# EasyEDA schematic SCH_Boom-Crane-Controller_2025-03-01.json
TITLE: Sheet_1; REV: 1.0; Date: 2024-06-13; Sheet: 1/1; Drawn By: aarin.khadpe; Company: Your Company
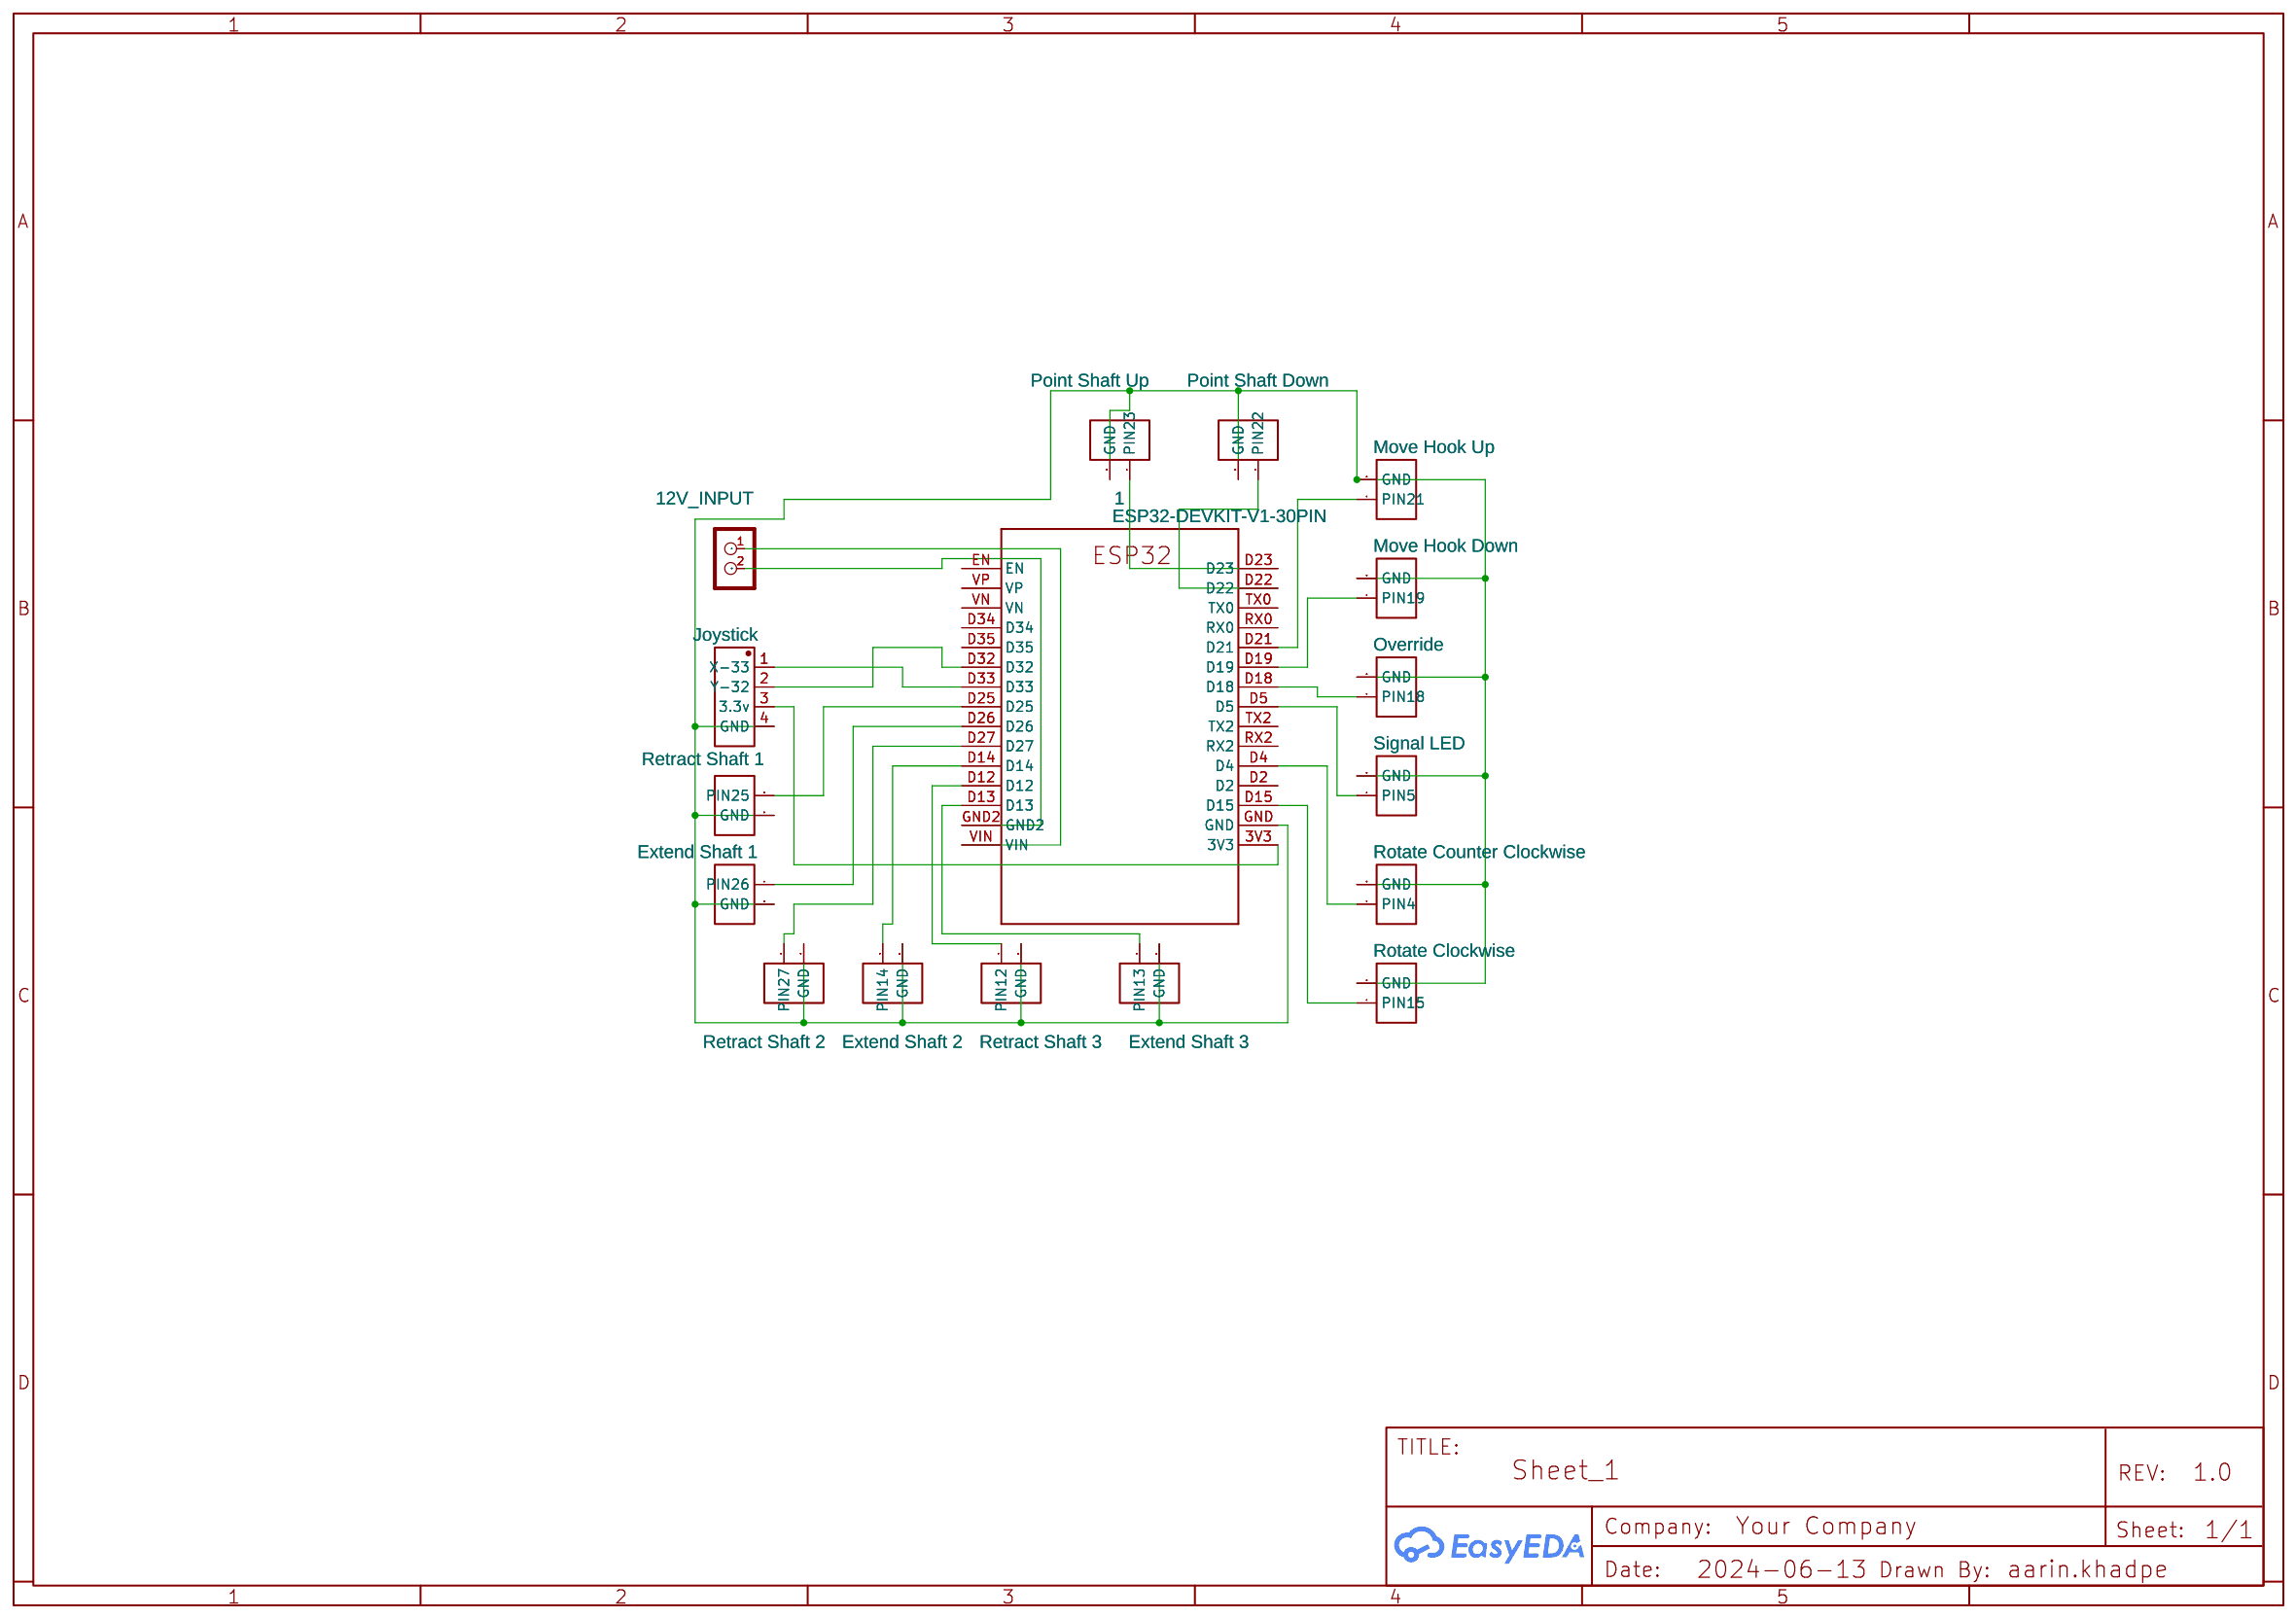
[diagram p0: schematic sheet]

## Parts
1  ESP32-DEVKIT-V1-30PIN  [ESP32-DEVKITV1_ESP32-DEVKITV1-30PINS]
12V_INPUT  CON_TERMINAL_BLOCK_02-5MM  [TERMINAL_BLOCK_2P_5]
H1  Joystick  [HDR-TH_4P-P2.54-V-M]
P1  Extend Shaft 1  [HDR-TH_2P-P2.54-V-F]
P2  Retract Shaft 1  [HDR-TH_2P-P2.54-V-F]
P3  Extend Shaft 2  [HDR-TH_2P-P2.54-V-F]
P4  Retract Shaft 2  [HDR-TH_2P-P2.54-V-F]
P5  Retract Shaft 3  [HDR-TH_2P-P2.54-V-F]
P6  Extend Shaft 3  [HDR-TH_2P-P2.54-V-F]
P7  Point Shaft Up  [HDR-TH_2P-P2.54-V-F]
P8  Point Shaft Down  [HDR-TH_2P-P2.54-V-F]
P9  Move Hook Down  [HDR-TH_2P-P2.54-V-F]
P10  Move Hook Up  [HDR-TH_2P-P2.54-V-F]
P11  Rotate Clockwise  [HDR-TH_2P-P2.54-V-F]
P12  Rotate Counter Clockwise  [HDR-TH_2P-P2.54-V-F]
P13  Override  [HDR-TH_2P-P2.54-V-F]
P14  Signal LED  [HDR-TH_2P-P2.54-V-F]

## Library data of the parts
1 = ESP32-DEVKIT-V1-30PIN: Contributor: petrawilliamleka
12V_INPUT = CON_TERMINAL_BLOCK_02-5MM: 2 poles wire to board terminal block; Contributor: DangerousPrototype
H1 = Header-Male-2.54_1x4_C59481: Supplier: LCSC; Manufacturer: null; Manufacturer Part: 排针 1*4P; Supplier Part: C59481; JLCPCB Part Class: Extended Part
P1-P14 = Header-Female-2.54_1x2: Supplier: LCSC; Manufacturer: BOOMELE(博穆精密); Manufacturer Part: 2.54-1*2P母; Supplier Part: C49661; JLCPCB Part Class: Extended Part

## Nets
Net-(1-3V3): 1.3V3 H1.3(3.3v)
Net-(1-D4): 1.D4 P12.1(PIN4)
Net-(1-D5): 1.D5 P14.1(PIN5)
Net-(1-D12): 1.D12 P5.1(PIN12)
Net-(1-D13): 1.D13 P6.1(PIN13)
Net-(1-D14): 1.D14 P3.1(PIN14)
Net-(1-D15): 1.D15 P11.1(PIN15)
Net-(1-D18): 1.D18 P13.1(PIN18)
Net-(1-D19): 1.D19 P9.1(PIN19)
Net-(1-D21): 1.D21 P10.1(PIN21)
Net-(1-D22): 1.D22 P8.1(PIN22)
Net-(1-D23): 1.D23 P7.1(PIN23)
Net-(1-D25): 1.D25 P2.1(PIN25)
Net-(1-D26): 1.D26 P1.1(PIN26)
Net-(1-D27): 1.D27 P4.1(PIN27)
Net-(1-D32): 1.D32 H1.2(Y-32)
Net-(1-D33): 1.D33 H1.1(X-33)
Net-(1-GND2): 1.GND2 12V_INPUT.2
Net-(1-GND): 1.GND H1.4(GND) P1.2(GND) P2.2(GND) P3.2(GND) P4.2(GND) P5.2(GND) P6.2(GND) P7.2(GND) P8.2(GND) P9.2(GND) P10.2(GND) P11.2(GND) P12.2(GND) P13.2(GND) P14.2(GND)
Net-(1-VIN): 1.VIN 12V_INPUT.1

Not connected (* = marked no-connect by the designer): 1 D2 D34 D35 EN RX0 RX2 TX0 TX2 VN VP
